# EAGLE design 452_speaker101 (EAGLE 9.6.2)
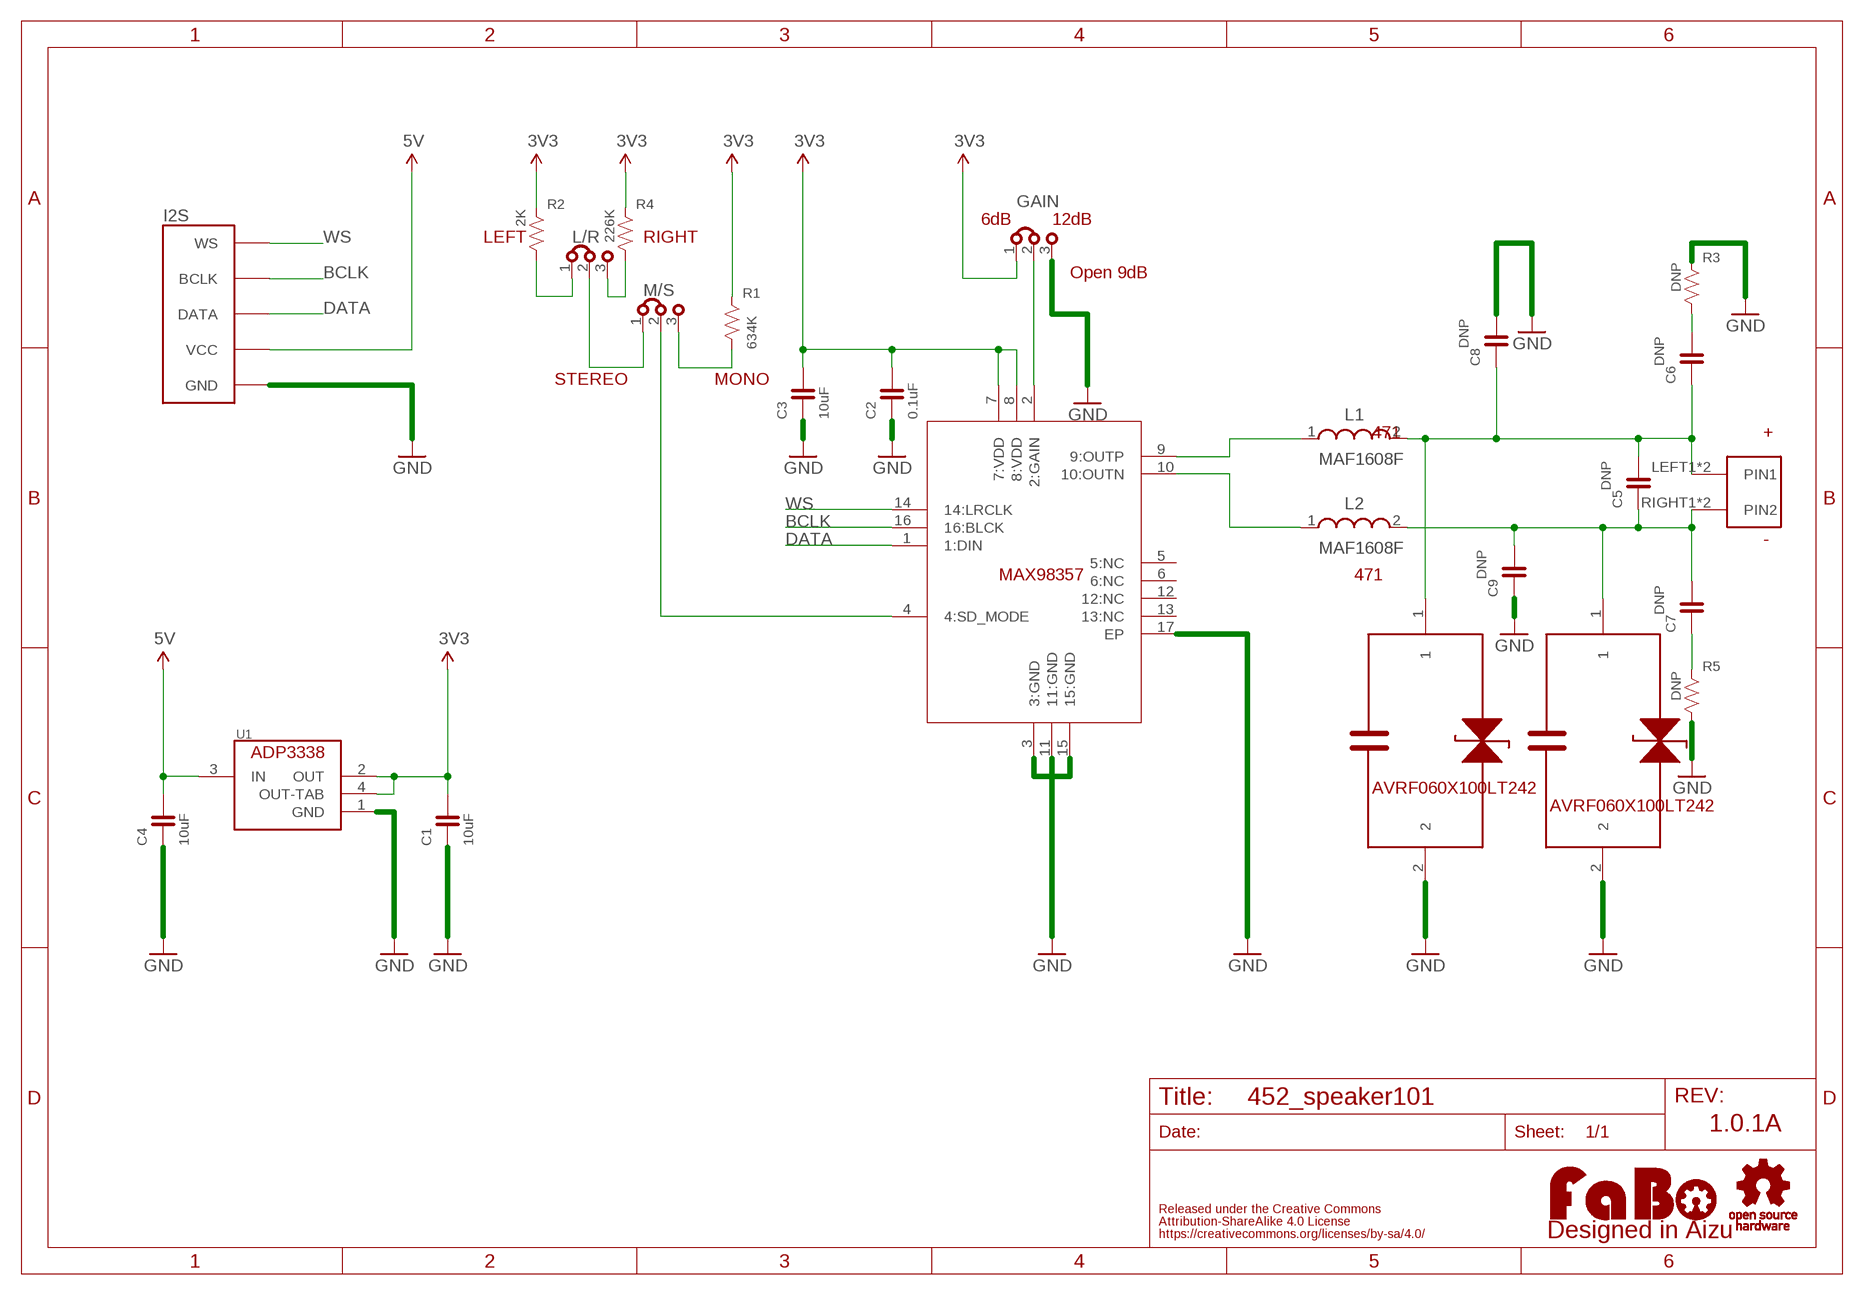
[diagram p0: schematic, sheet 1]

## Parts
C1  10uF  CAPACITOR-0603  [0603]
C2  0.1uF  CAPACITOR-0603  [0603]
C3  10uF  CAPACITOR-0603  [0603]
C4  10uF  CAPACITOR-0603  [0603]
C5  DNP  CAPACITOR-0603  [0603]
C6  DNP  CAPACITOR-0603  [0603]
C7  DNP  CAPACITOR-0603  [0603]
C8  DNP  CAPACITOR-0603  [0603]
C9  DNP  CAPACITOR-0603  [0603]
GAIN  JUMPERS_JP2-2MM  [JUMPERS_JP2-2MM]
I2S  FABO_BRICK_I2S  [FABO_BRICK_I2S]
L1  MAF1608F  [MAF1608F]
L2  MAF1608F  [MAF1608F]
L/R  JUMPERS_JP2-2MM  [JUMPERS_JP2-2MM]
LOGO1  LOGO_FABO-M  [LOGO_FABO_M]
M/S  JUMPERS_JP2-2MM  [JUMPERS_JP2-2MM]
R1  634K  RESISTOR-0603  [0603]
R2  2K  RESISTOR-0603  [0603]
R3  DNP  RESISTOR-0603  [0603]
R4  226K  RESISTOR-0603  [0603]
R5  DNP  RESISTOR-0603  [0603]
U1  ADP3338AKCZ  [SOT-223-KC3]
U$2  MAX98357A,B  [TQFN(16L3*3*0.75)]
U$3  LOGO_OSHW-M_BOTTOM  [LOGO_OSHW_M_BOTTOM]
U$4  ML-1400-S1  [ML-1400-S1]
U$5  AVRF060X100LT242  [AVRF0X0X100LT_0603]
U$6  AVRF060X100LT242  [AVRF0X0X100LT_0603]

## Nets
3V3: C1.2 C2.2 C3.2 GAIN.1 R1.1 R2.1 R4.1 U1.2(OUT) U1.4(OUT-TAB) U$2.7(7:VDD) U$2.8(8:VDD)
5V: C4.2 I2S.VCC U1.3(IN)
BCLK: I2S.BCLK U$2.16(16:BLCK)
DATA: I2S.DATA U$2.1(1:DIN)
GND: C1.1 C2.1 C3.1 C4.1 C8.2 C9.1 GAIN.3 I2S.GND R3.1 R5.2 U1.1(GND) U$2.3(3:GND) U$2.11(11:GND) U$2.15(15:GND) U$2.17(EP) U$5.2 U$6.2
N$1: L2.1 U$2.10(10:OUTN)
N$2: L1.1 U$2.9(9:OUTP)
N$3: C5.1 C7.2 C9.2 L2.2 U$4.RIGHT1(PIN2) U$4.RIGHT2(PIN2) U$6.1
N$4: GAIN.2 U$2.2(2:GAIN)
N$6: L/R.2 M/S.1
N$7: M/S.2 U$2.4(4:SD_MODE)
N$8: M/S.3 R1.2
N$9: C5.2 C6.1 C8.1 L1.2 U$4.LEFT1(PIN1) U$4.LEFT2(PIN1) U$5.1
N$10: L/R.1 R2.2
N$11: L/R.3 R4.2
N$32: C6.2 R3.2
N$33: C7.1 R5.1
WS: I2S.WS U$2.14(14:LRCLK)
Unconnected: U$2.5(5:NC) U$2.6(6:NC) U$2.12(12:NC) U$2.13(13:NC)

## Notes on the sheet
- 6dB | 12dB
- LEFT | RIGHT
- Open 9dB
- STEREO | MONO
- 471 | +
- -
- 471
- AVRF060X100LT242
- AVRF060X100LT242
- 1.0.1A

## Library data of the parts
C1-C9 = FaBo-Capacitor:CAPACITOR: CAPACITOR
GAIN L/R M/S = 52101-101-REV-A_v16:JUMPERS_JP2-: Jumper/Bridge
I2S = FaBo-Template:FABO_BRICK_I2S
L1 L2 = FaBo-Coil:MAF1608F: Noise suppression Filter for audio line(Class D amplifer noise suppression) TDK MAF series MAF1608F Type sound line device
LOGO1 = component:LOGO_FABO
R1-R5 = FaBo-Resistors:RESISTOR: RESISTOR
U1 = FaBo-Supply:ADP3338AKCZ
U$2 = FaBo-AudioIC:MAX98357A,B
U$3 = component:LOGO_OSHW
U$4 = FaBo-Terminal:ML-1400-S1
U$5 U$6 = FaBo-Coil:AVRF060X100LT242: ESD Notch Filters For wireless audio equipment TDK AVRF series ESD protection and noise protechtion.

## Board
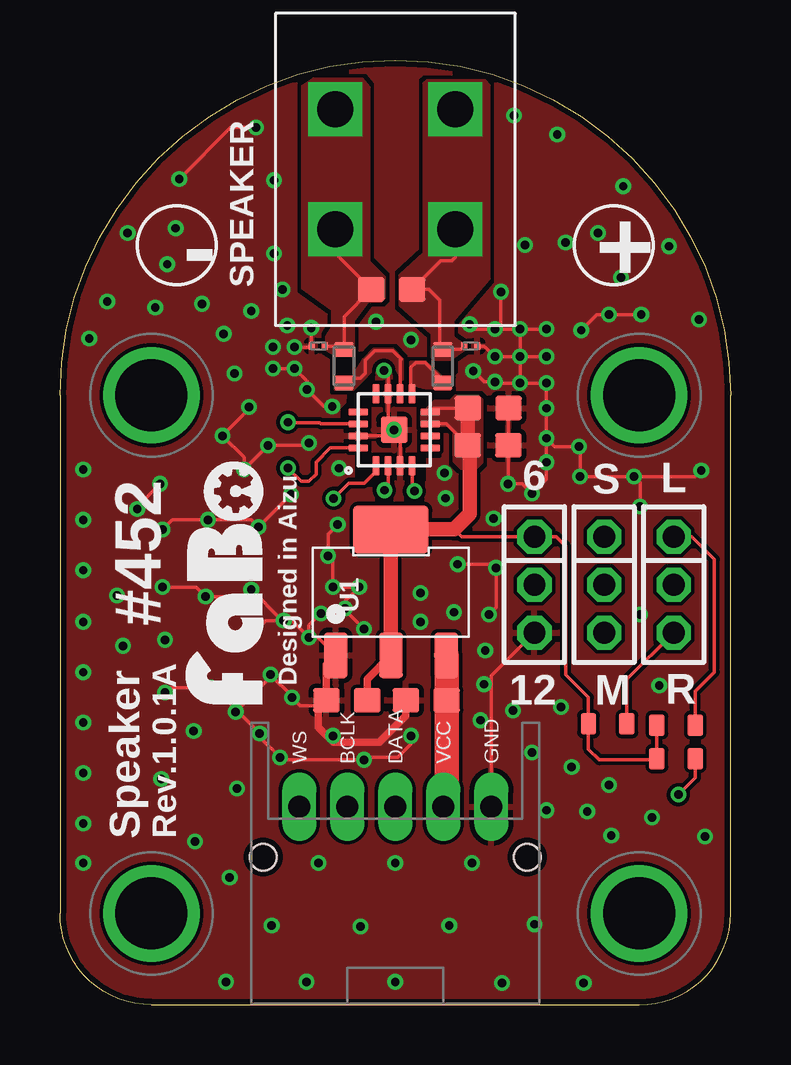
[diagram p1: board, top side]
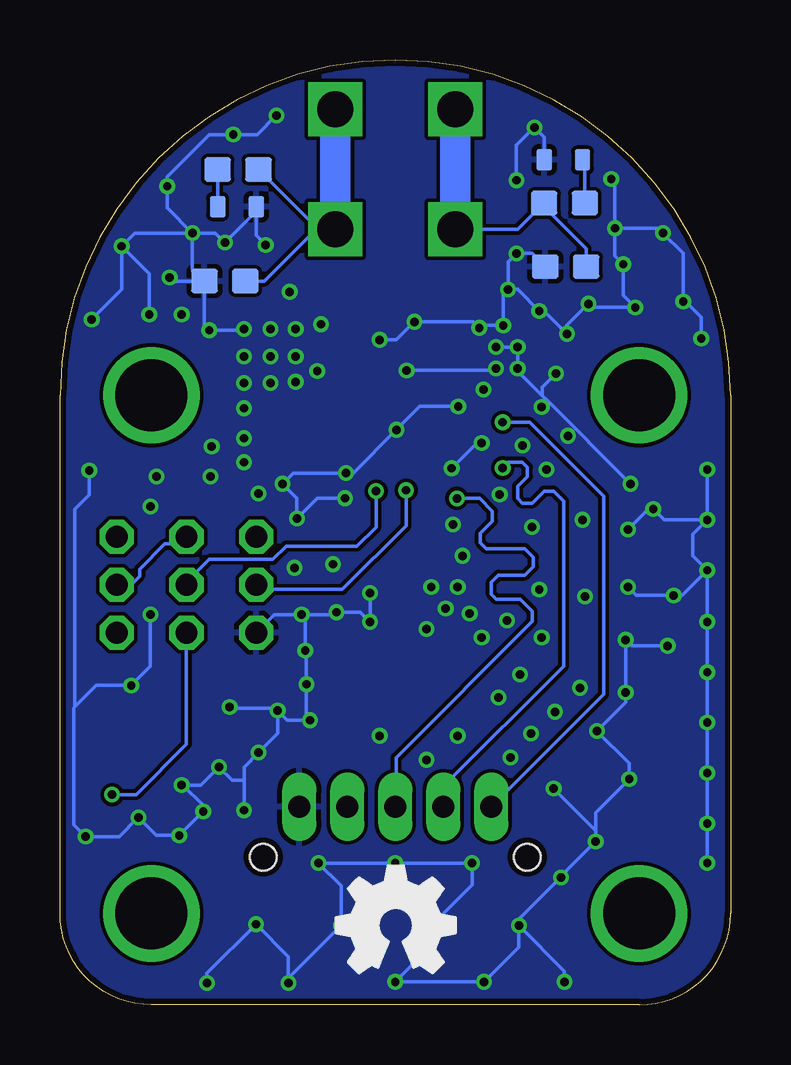
[diagram p2: board, bottom side, seen from below]

Size 27.94 x 39.37 mm. Coordinates in mm from the lower left corner, seen from the top.
Copper layers (1*16): Top 0.035mm / dielectric 1.6mm / Bottom 0.035mm
Design rules "PCBway": minimum track width 6mil, minimum drill 12mil, track to track 6mil, track to pad 6mil, pad to pad 6mil, via to via 6mil, smd to smd 6mil, copper to edge 10mil, drill to drill 10mil, minimum pad ring 10mil, minimum via ring 6mil, stop-mask expansion 2mil, vias tented up to drill 100mil, thermal gap 8mil
tRestrict: 12 lines

### Footprints (pad centres in the part's own frame; a part is rotated, then mirrored left to right if it is on the bottom)
0603 = smd 1.1 x 1: 1 -0.85,0; 2 0.85,0
JUMPERS_JP2-2MM = drill 0.914 octagon: 1 -2,0; 2 0,0; 3 2,0
FABO_BRICK_I2S = drill 0.9 pad 1.422 long: BCLK -2,-8.255; DATA 0,-8.255; GND 4,-8.255; VCC 2,-8.255; WS -4,-8.255 | drill 3 pad 3.81: P$1 -10.16,8.89; P$2 10.16,8.89; P$3 -10.16,-12.7; P$4 10.16,-12.7 | hole 1.1: -5.5,-10.355; 5.5,-10.355
MAF1608F = smd 0.6 x 0.8: 1 -0.7,0; 2 0.7,0
0603' = smd 0.65 x 0.9: 1 -0.8,0; 2 0.8,0
SOT-223-KC3 = smd 1 x 1.9: 1 -2.3,-2.625; 2 0,-2.625; 3 2.3,-2.625 | smd 3.15 x 2: 4 0,2.625
TQFN(16L3*3*0.75) = smd 0.28 x 0.8: 1 -0.75,-1.5; 2 -0.25,-1.5; 3 0.25,-1.5; 4 0.75,-1.5; 9 0.75,1.5; 10 0.25,1.5; 11 -0.25,1.5; 12 -0.75,1.5 | smd 0.8 x 0.28: 5 1.5,-0.75; 6 1.5,-0.25; 7 1.5,0.25; 8 1.5,0.75; 13 -1.5,0.75; 14 -1.5,0.25; 15 -1.5,-0.25; 16 -1.5,-0.75 | smd 1.1 x 1.1: 17 0,0
ML-1400-S1 = drill 1.5 square: LEFT1 -2.5,2.5; LEFT2 -2.5,-2.5; RIGHT1 2.5,2.5; RIGHT2 2.5,-2.5
AVRF0X0X100LT_0603 = smd 0.25 x 0.3: 1 -0.275,0; 2 0.275,0

### Placement (x,y rotation side)
C1  11.95,12.69 0 top
C2  17.84,23.32 180 top
C3  17.84,24.87 180 top
C4  15.26,12.7 0 top
C5  13.82,29.81 0 top
C6  20.52,34.81 180 bottom
C7  6.92,33.41 180 bottom
C8  21.07,30.16 180 bottom
C9  6.87,30.76 0 bottom
GAIN  19.77,17.51 270 top
I2S  13.97,16.51 0 top
L1  15.95,26.62 90 top
L2  11.84,26.62 90 top
L/R  25.57,17.51 270 top
LOGO1  8.85,17.59 90 top
M/S  22.67,17.51 270 top
R1  634K  [0603']  25.67,10.26 0 top
R2  2K  [0603']  25.67,11.66 0 top
R3  DNP  [0603']  20.57,33.26 180 bottom
R4  226K  [0603']  22.82,11.71 0 top
R5  DNP  [0603']  6.97,35.21 180 bottom
U1  13.79,17.19 0 top
U$2  13.92,23.96 0 top
U$3  13.94,3.32 0 top
U$4  13.97,34.81 180 top
U$5  17.12,27.45 0 top
U$6  10.77,27.45 180 top

### Tracks (layer width: path | path; a pad name or v marks a point on that pad's centre or on a via)
3V3
  Top 0.152: R2.1 R1.1 24.82,10.21 22.47,10.21 22.02,10.66 R4.1 22.02,12.81 21.07,13.76 21.07,19.11 20.67,19.51 GAIN.1 16.73,19.51 16.42,19.82 | 14,19.61 U1.4 14.1,19.51 | U$2.8 15.57,24.86 C3.2 | U$2.7 16.09,24.21 C2.2
  Top 0.305: 12.8,13.03 C1.2 12.8,13.58 U1.2 | C2.2 16.87,23.21 | 16.99,24.23 C3.2
  Top 0.61: 16.87,23.21 17.07,23.01 17.07,20.46 16.42,19.82 U1.4 U1.2 | C2.2 C3.2
  pour Top (no thermals): 15.07,24.16 15.07,24.71 15.17,24.71 15.62,25.16 16.27,25.16 16.47,25.36 17.42,25.36 17.57,25.21 17.57,22.61 17.32,22.36 16.72,22.36 16.42,22.66 16.42,24.01 16.27,24.16
5V
  Top 0.305: 16.02,12.61 C4.2
  Top 1.016: U1.3 16.11,14.55 C4.2 16.11,8.4 I2S.VCC
BCLK  (via drill 0.35)
  Top 0.152: v9.5,22.37 10.06,21.81 10.37,21.81 10.67,22.11 10.67,22.61 11.27,23.21 U$2.16
  Bottom 0.152: I2S.BCLK 11.97,9.1 6.96,14.12 6.96,21 7.37,21.41 7.77,21.41 8.27,20.91 8.67,20.91 8.87,21.11 8.87,21.61 8.47,22.01 8.47,22.41 8.67,22.61 9.26,22.61 v9.5,22.37
DATA  (via drill 0.35)
  Top 0.152: v11.4,21.1 12.04,21.74 12.67,21.74 13.17,22.24 U$2.1
  Bottom 0.152: I2S.DATA 13.94,8.29 13.94,10.31 8.27,15.98 8.27,16.41 8.77,16.91 9.77,16.91 9.97,17.11 9.97,17.61 9.67,17.91 8.57,17.91 8.22,18.26 8.22,18.66 8.57,19.01 10.17,19.01 10.42,19.26 10.42,19.66 9.92,20.16 9.92,20.56 10.46,21.1 v11.4,21.1
GND  (via drill 0.35)
  Top 0.152: C3.1 18.69,24.86 C2.1 18.69,21.73 v18.67,21.71 19.27,21.71 v19.67,21.31 20.27,21.91 v20.27,22.61 v20.27,23.61 | GAIN.3 17.97,13.71 I2S.GND | U$5.2 17.68,27.45 v18.12,27.01 v19.17,27.01 | v4.97,34.41 7.12,36.56 v8.17,36.56 | v14.62,11.21 14.62,10.86 14.07,10.31 12.77,10.31 v12.67,10.21 9.27,10.21 v9.17,10.31 8.32,11.16 v8.32,11.31 7.42,12.21 v7.32,12.21 7.4,12.29 | 7.4,12.29 8.77,13.66 v8.77,13.76 9.67,12.86 v9.67,12.81 10.02,12.46 10.87,12.46 | v10.47,28.21 10.47,27.47 U$6.2 10.45,27.41 v9.77,27.41 | v8.87,26.51 v9.77,26.51 10.29,25.99 v10.29,25.64 11,24.94 v11.35,24.94 | v7.87,24.91 7.87,24.81 v6.77,23.71 7.67,22.81 v7.67,22.31 v8.67,23.31 10.27,23.31 v10.37,23.41 | v16.57,18.36 18.02,18.36 v18.17,18.21 18.17,16.56 v17.87,16.26 | v20.27,23.61 20.62,23.26 v21.62,23.26 21.67,23.21 v21.67,22.01 v23.92,22.01 | v23.92,22.01 24.17,21.76 v24.17,20.76 | v23.92,22.01 26.47,22.01 v26.72,22.26 | v20.27,23.61 v20.27,24.86 v20.27,25.91 v19.17,25.91 | v19.17,25.91 18.17,25.91 v18.12,25.96 17.67,25.96 v17.22,26.41 | v19.17,25.91 v19.17,27.01 | v19.17,27.01 v20.27,27.01 | v19.17,27.01 v19.17,28.16 | v19.17,28.16 18.17,28.16 | 18.17,28.16 v18.12,28.16 17.27,28.16 v17.07,28.36 | v18.37,29.71 18.37,28.36 18.17,28.16 | v19.17,28.16 v20.27,28.16 | v21.72,28.11 22.37,28.76 v22.87,28.76 v24.22,28.76 | v4.27,17.41 5.67,17.41 v6.07,17.01 7.67,17.01 v7.97,17.31 9.27,16.01 v9.32,16.01 | v9.32,16.01 8.57,16.01 v7.87,15.31 | v4.27,19.81 4.67,20.21 v6.17,20.21 7.97,20.21 v8.27,19.91 v9.62,21.26 | v11.57,20.01 11.17,19.61 v11.17,18.71 11.37,18.51 v11.37,17.41 v12.47,17.41 11.87,16.81 v11.87,16.51
  Top 0.152: v11.87,16.51 11.67,16.31 v10.87,16.31 10.37,15.81 v10.37,15.31 | v10.37,15.31 9.67,16.01 v9.32,16.01 | v12.67,15.66 11.87,16.46 v11.87,16.51 | v10.37,15.31 10.75,15.31 U1.1 | v4.37,13.01 4.57,13.21 v6.27,13.21 6.47,13.21 7.4,12.29 | v11.37,11.21 11.3,11.14 11.2,11.14 | v3.22,20.66 3.22,20.76 v4.17,21.71 | 13.77,23.96 13.67,24.06 U$2.11 13.67,26.26 v13.5,26.44 | 13.77,23.96 13.92,23.81 13.82,23.71 U$2.15 | 14,23.89 U$2.17 | U$2.3 14.17,23.71 U$2.17 | U$2.17 13.77,23.96
  Top 0.305: U1.1 11.1,14.18 C1.1 10.87,12.46 10.77,12.36 10.77,11.58 11.2,11.14 11.4,10.94 13.31,10.94 14.41,12.05 C4.1
  Bottom 0.152: v16.07,21.11 17.22,21.11 v18.07,20.26 18.07,21.11 v18.67,21.71 18.22,22.16 v16.02,22.16 15.72,22.16 U$2.17 12.95,24.94 v11.35,24.94 | 19.77,33.06 19.77,32.06 v19.37,31.66 | C8.2 22.42,30.66 v22.42,32.16 | 19.77,33.06 v21.07,31.76 21.47,32.16 v22.42,32.16 | 19.77,33.06 R3.1 | v22.42,32.16 23.47,33.21 v23.47,34.11 23.47,34.51 21.72,36.26 v20.72,36.26 19.72,36.26 v18.92,37.06 | C8.2 21.92,28.31 v21.72,28.11 20.32,28.11 v20.27,28.16 | v22.42,32.16 24.82,32.16 v25.37,31.61 | v24.22,28.76 24.22,30.46 v25.37,31.61 | v25.37,31.61 25.37,29.81 v26.62,28.56 | v14.62,27.71 13.92,27.71 v13.17,28.46 10.72,28.46 v10.47,28.21 10.37,28.31 v9.47,28.31 9.47,29.61 v9.27,29.81 | v4.97,34.41 4.82,34.26 v4.82,32.36 | C9.1 8.27,31.31 v8.92,31.31 9.27,30.96 v9.27,29.81 | R5.2 7.77,36.16 v8.17,36.56 8.92,35.81 v8.92,34.36 | v1.97,29.31 1.97,29.41 | 1.97,29.41 1.97,31.31 v2.82,32.16 3.02,32.36 v4.82,32.36 | v4.82,32.36 4.82,31.21 v4.47,30.86 4.47,29.56 v3.97,29.06 5.77,29.06 v5.92,29.21 6.82,28.31 v6.82,27.96 7.77,28.91 v7.97,28.91 8.87,29.81 v9.27,29.81 | v4.17,21.71 7.65,25.19 | 7.65,25.19 7.85,25.39 | 7.85,25.39 8.87,26.41 v8.87,26.51 v8.87,27.41 v9.77,27.41 | v7.27,26.31 7.85,25.74 7.85,25.39 | v7.87,24.91 7.65,25.14 7.65,25.19 | v11.62,22.36 10.57,23.41 v10.37,23.41 | v1.22,27.76 1.22,28.66 1.97,29.41 | v0.97,22.31 v0.97,20.21 | v0.97,20.21 1.57,19.61 1.57,18.71 v0.97,18.11 | v0.97,18.11 v0.97,15.96 v0.97,13.86 v0.97,11.76 v0.97,9.66 v0.97,7.56 v0.97,5.91 | v2.62,14.96 4.12,14.96 v4.37,15.21 v4.37,13.01 4.37,12.61 v5.57,11.41 4.22,10.06 v4.22,9.41 5.62,8.01 v5.62,6.81 | v5.62,6.81 5.62,7.26 v7.37,9.01
  Bottom 0.152: v5.62,6.81 7.07,5.36 v7.07,5.31 8.82,3.56 v8.82,3.31 | v8.82,3.31 6.92,1.41 v6.92,0.96 | v8.82,3.31 8.82,2.41 v10.27,0.96 v13.97,0.96 12.52,2.41 v12.52,3.26 10.77,5.01 v10.77,5.91 v13.97,5.91 v17.17,5.91 16.22,4.96 v16.22,3.31 18.42,1.11 v18.42,0.91 18.42,2.01 v19.77,3.36 21.82,1.31 v21.82,0.91 | v20.27,8.11 20.27,9.36 | 20.27,9.36 20.27,9.91 v19.67,10.51 18.87,11.31 v18.87,12.26 | 20.27,9.36 20.77,9.36 v21.32,9.91 22.07,9.16 22.82,9.16 | v22.87,9.16 22.82,9.16 | 22.82,9.16 21.97,8.31 v21.97,8.06 v22.97,7.06 23.92,7.06 v24.67,7.81 25.47,7.01 v26.87,7.01 27.37,7.51 27.37,12.36 27.3,12.44 | v18.87,12.26 18.47,11.86 v17.52,11.86 17.67,12.01 v17.67,13.36 17.67,14.71 v17.72,14.76 17.72,16.11 v17.87,16.26 | v20.87,12.41 20.82,12.36 18.97,12.36 v18.87,12.26 | v17.87,16.26 19.02,16.26 GAIN.3 | v17.87,16.26 16.52,16.26 v16.42,16.36 15.42,16.36 v15.02,15.96 v15.02,17.16 | C8.2 23.22,30.16 v23.37,30.31 | v0.97,20.21 2.77,20.21 v3.22,20.66 3.42,20.66 v4.27,19.81 | v0.97,18.11 2.02,17.06 v2.37,17.06 3.92,17.06 v4.27,17.41 | v24.17,16.26 24.17,14.11 v24.97,13.31 26.42,13.31 27.3,12.44 | v26.72,22.26 26.72,21.26 27.32,20.66 27.32,12.46 27.3,12.44 | v13.5,26.44 9.85,26.44 v9.77,26.51
  other vias: 13.92,23.96
  pour Bottom: -0.03,-0.49 28.34,-0.49 28.34,39.51 -0.03,39.51
  pour Top (rank 6): -0.03,-0.49 28.34,-0.49 28.34,39.51 -0.03,39.51
N$1
  Top 0.152: L2.1 12.03,26.11 12.52,26.11 12.72,26.31 12.72,26.86 13.12,27.26 13.87,27.26 14.22,26.91 14.17,26.86 U$2.10
  pour Top (no thermals): 11.47,25.66 11.47,26.16 12.22,26.16 12.67,26.91 13.07,27.31 13.87,27.31 14.27,26.91 14.27,26.06 13.86,26.81 13.37,26.81 12.22,25.66
N$2
  Top 0.152: 14.62,25.55 14.62,26.56 14.82,26.76 15.22,26.76 15.95,26.04 L1.1
  pour Top (no thermals): 14.62,26.79 15.25,26.79 16.02,26.06 16.02,25.71 15.25,25.71 14.67,25.86
N$3
  Top 0.152: U$6.1 11.7,27.45 L2.2 11.84,28.68 C5.1 11.47,31.31 U$4.RIGHT1
  Bottom 0.152: U$4.RIGHT1 8.87,32.31 7.85,33.34 | 7.85,33.34 C7.2 | C9.2 6.02,31.51 7.85,33.34
  Bottom 1.27: U$4.RIGHT2 U$4.RIGHT1
  pour Top (no thermals): 11.12,27.31 11.12,27.81 11.37,28.21 11.37,28.96 10.12,29.86 10.12,38.28 10.56,38.56 12.58,38.56 12.87,38.23 12.87,30.96 13.52,30.31 13.52,29.46 13.37,29.31 12.82,29.31 12.22,28.51 12.22,27.11 11.52,27.06
N$4  (via drill 0.35)
  Top 0.152: v13.52,21.45 13.67,21.6 U$2.2
  Bottom 0.152: GAIN.2 19.57,17.31 16.17,17.31 13.52,19.96 v13.52,21.45
N$6
  Bottom 0.152: L/R.2 24.97,17.51 24.62,17.86 24.62,18.16 23.57,19.21 23.07,19.21 22.77,19.51 M/S.1
N$7  (via drill 0.35)
  Top 0.152: v14.77,21.41 14.67,21.51 U$2.4
  Bottom 0.152: M/S.2 22.67,17.61 21.72,18.56 19.07,18.56 18.52,19.11 15.57,19.11 14.77,19.91 v14.77,21.41
N$8  (via drill 0.35)
  Top 0.152: v25.77,8.76 26.47,9.46 R1.2
  Bottom 0.152: M/S.3 22.67,10.86 24.77,8.76 v25.77,8.76
N$9
  Top 0.152: U$5.1 16.7,27.32 L1.2 15.82,27.44 15.82,29.36 15.37,29.81 C5.2 15.87,31.01 16.32,31.01 16.47,31.16 U$4.LEFT1
  Bottom 0.152: C6.1 17.17,32.31 | 17.17,32.31 16.57,32.31 U$4.LEFT1 | C8.1 19.42,30.16 17.27,32.31 17.17,32.31
  Bottom 1.27: U$4.LEFT2 U$4.LEFT1
  pour Top (no thermals): 15.52,27.01 15.52,27.96 14.17,29.16 14.17,30.41 15.17,31.31 15.17,38.39 15.31,38.51 17.71,38.51 17.87,38.32 17.87,30.26 16.37,28.51 16.37,27.81 16.72,27.56 16.87,27.46 16.87,27.31 16.27,26.91 15.67,26.91
N$10
  Top 0.152: R2.2 26.47,13.06 27.27,13.86 27.27,18.56 26.32,19.51 L/R.1
N$11
  Top 0.152: R4.2 23.62,13.56 L/R.3
N$32
  Bottom 0.152: R3.2 C6.2
N$33
  Bottom 0.152: C7.1 6.07,35.11 R5.1
WS  (via drill 0.35)
  Top 0.152: v9.5,24.28 9.54,24.23 9.58,24.26 10.82,24.26 10.87,24.21 U$2.14
  Bottom 0.152: I2S.WS 5.29,12.94 5.29,21.2 8.36,24.28 v9.5,24.28

### Text on the board
tPlace: - | + | SPEAKER | 6 | S | L | #452 | Designed in Aizu | 12 | M | R | Speaker | Rev.1.0.1A